# EAGLE design robot (EAGLE 9.6.2)
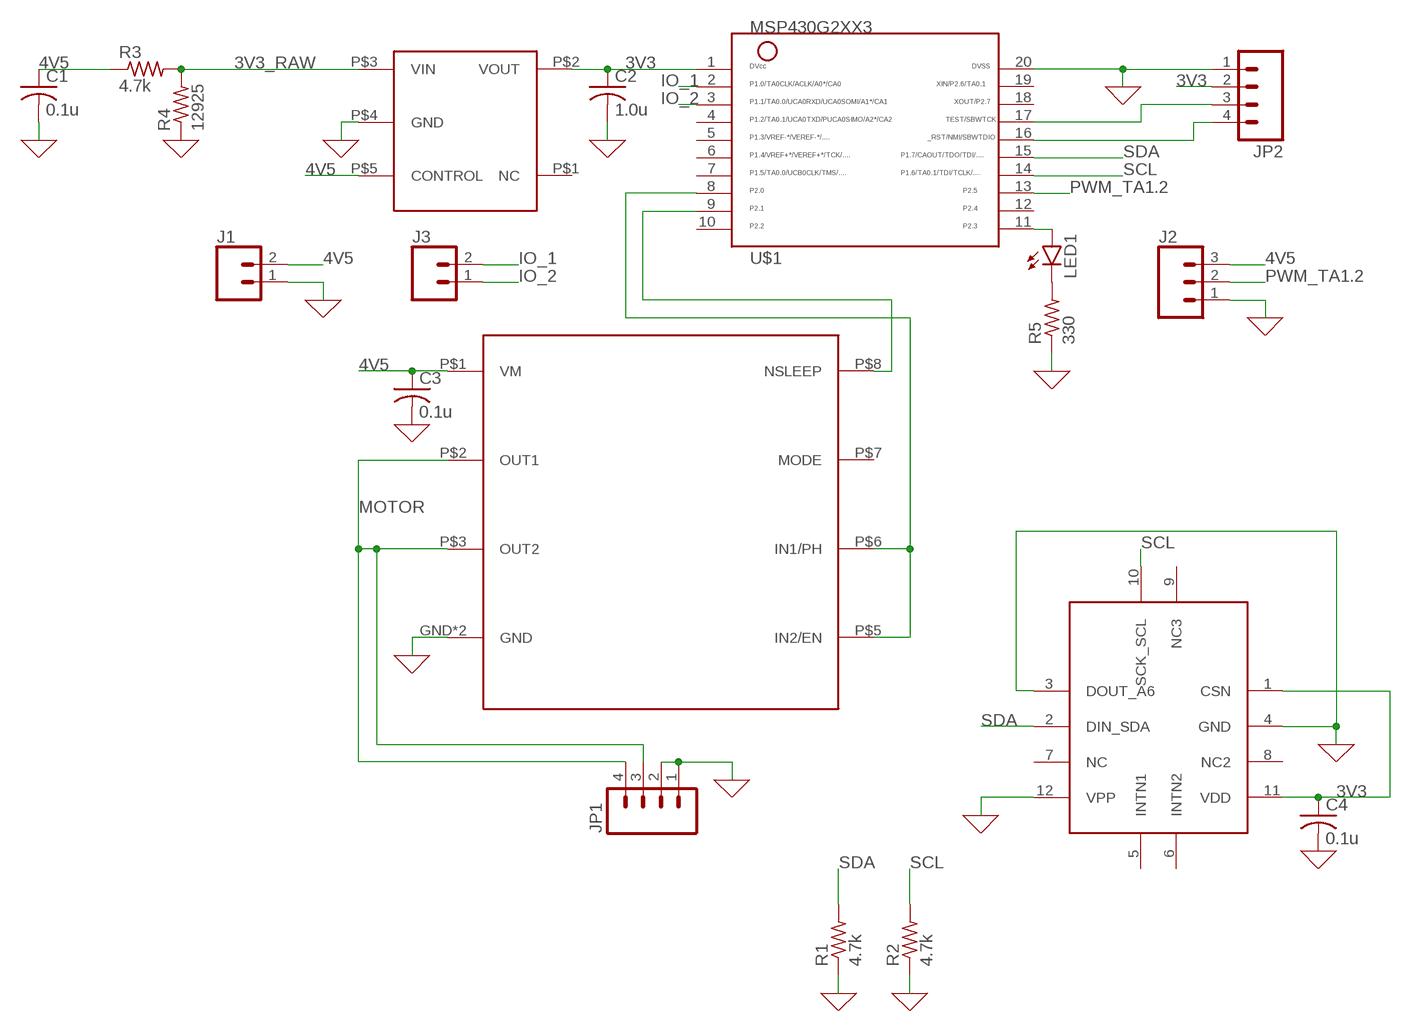
[diagram p0: schematic, sheet 1]

## Parts
C1  0.1u  C-USC0805  [C0805]
C2  1.0u  C-USC0805  [C0805]
C3  0.1u  C-USC0805  [C0805]
C4  0.1u  C-USC0805  [C0805]
J1  CONN_02  [1X02]
J2  CONN_03LOCK  [1X03_LOCK]
J3  CONN_02  [1X02]
JP1  HEADER_1X04LOCK  [1X04_LOCK]
JP2  HEADER_1X04LOCK  [1X04_LOCK]
LED1  LED5MM  [LED5MM]
R1  4.7k  R-US_R0805  [R0805]
R2  4.7k  R-US_R0805  [R0805]
R3  4.7k  R-US_R0805  [R0805]
R4  12925  R-US_R0805  [R0805]
R5  330  R-US_R0805  [R0805]
U$1  MSP430G2XX3PDIP  [N20]
U$2  DRV8220_H_BRIDGE  [DRV8220_H_BRIDGE]
U$4  TCR2EF3V3  [TCR2EF3V3]
U$5  MC3419VFLGA-12  [IC_MXC6655XA]

## Nets
0: C1.2 C2.2 C3.2 C4.2 J1.1 J2.1 JP1.1 JP1.2 JP2.1 R1.1 R2.1 R4.1 R5.1 U$1.20 U$2.GND U$2.P$4(GND) U$4.P$4(GND) U$5.3(DOUT_A6) U$5.4(GND) U$5.12(VPP) ; supply symbol labelled GND
3V3: C2.1 C4.1 JP2.2 U$1.1 U$4.P$2(VOUT) U$5.1(CSN) U$5.11(VDD)
3V3_RAW: R3.2 R4.2 U$4.P$3(VIN)
4V5: C1.1 C3.1 J1.2 J2.3 R3.1 U$2.P$1(VM) U$4.P$5(CONTROL)
IO_1: J3.2 U$1.2
IO_2: J3.1 U$1.3
MOTOR: JP1.3 JP1.4 U$2.P$2(OUT1) U$2.P$3(OUT2)
N$1: LED1.A U$1.11
N$2: U$1.9 U$2.P$8(NSLEEP)
N$3: LED1.K(C) R5.2
N$4: U$1.8 U$2.P$5(IN2/EN) U$2.P$6(IN1/PH)
N$10: JP2.3 U$1.17
N$11: JP2.4 U$1.16
PWM_TA1.2: J2.2 U$1.13
SCL: R2.2 U$1.14 U$5.10(SCK_SCL)
SDA: R1.2 U$1.15 U$5.2(DIN_SDA)
Unconnected: U$1.4 U$1.5 U$1.6 U$1.7 U$1.10 U$1.12 U$1.18 U$1.19 U$2.P$7(MODE) U$4.P$1(NC) U$5.5(INTN1) U$5.6(INTN2) U$5.7(NC) U$5.8(NC2) U$5.9(NC3)

## Library data of the parts
C1-C4 = rcl:C-US: CAPACITOR, American symbol; SPICEPREFIX: C
J1 J3 = SparkFun-Connectors:CONN_02: Multi connection point. Often used as Generic Header-pin footprint for 0.1 inch spaced/style header connections On any of the 0.1 inch spaced packages, you can populate with these: Break Away Headers - Straight <https://www.sparkfun.com/products/116> (PRT-00116) Break Away Male Headers - Right Angle <https://www.sparkfun.com/products/553> (PRT-00553) Female Headers <https://www.sparkfun.com/products/115> (PRT-00115) Break Away Headers - Machine Pin <https://www.sparkfun.com/products/117> (PRT-00117) Break Away Female Headers - Swiss Machine Pin <https://www.sparkfun.com/products/743> (PRT-00743) For SCREWTERMINALS and SPRING TERMINALS visit here: Screw Terimnals on SparkFun.com <https://www.sparkfun.com/search/results?term=Screw+Terminals> (5mm/3.5mm/2.54mm spacing) This device is also useful as a general connection point to wire up your design to another part of your project. Our various solder wires solder well into these plated through hole pads. Hook-Up Wire - Assortment (Stranded, 22 AWG) <https://www.sparkfun.com/products/11375> (PRT-11375) Hook-Up Wire - Assortment (Solid Core, 22 AWG) <https://www.sparkfun.com/products/11367> (PRT-11367) View the entire wire category on our website here <https://www.sparkfun.com/categories/141> Special notes: Molex polarized connector foot print use with: PRT-08233 with associated crimp pins and housings. 2.54_SCREWTERM for use with PRT-10571. 3.5mm Screw Terminal footprints for PRT-08084 5mm Screw Terminal footprints for use with PRT-08432
J2 = SparkFun-Connectors:CONN_03: Multi connection point. Often used as Generic Header-pin footprint for 0.1 inch spaced/style header connections On any of the 0.1 inch spaced packages, you can populate with these: Break Away Headers - Straight <https://www.sparkfun.com/products/116> (PRT-00116) Break Away Male Headers - Right Angle <https://www.sparkfun.com/products/553> (PRT-00553) Female Headers <https://www.sparkfun.com/products/115> (PRT-00115) Break Away Headers - Machine Pin <https://www.sparkfun.com/products/117> (PRT-00117) Break Away Female Headers - Swiss Machine Pin <https://www.sparkfun.com/products/743> (PRT-00743) Stackable Header - 3 Pin (Female, 0.1") <https://www.sparkfun.com/products/13875> (PRT-13875) For SCREWTERMINALS and SPRING TERMINALS visit here: Screw Terimnals on SparkFun.com <https://www.sparkfun.com/search/results?term=Screw+Terminals> (5mm/3.5mm/2.54mm spacing) This device is also useful as a general connection point to wire up your design to another part of your project. Our various solder wires solder well into these plated through hole pads. Hook-Up Wire - Assortment (Stranded, 22 AWG) <https://www.sparkfun.com/products/11375> (PRT-11375) Hook-Up Wire - Assortment (Solid Core, 22 AWG) <https://www.sparkfun.com/products/11367> (PRT-11367) View the entire wire category on our website here <https://www.sparkfun.com/categories/141> Special notes: Molex polarized connector foot print use with SKU : PRT-08232 with associated crimp pins and housings.
JP1 JP2 = ELEC327:HEADER_1X04: Header 4 Standard 4-pin 0.1" header. Use with straight break away headers (SKU : PRT-00116), right angle break away headers (PRT-00553), swiss pins (PRT-00743), machine pins (PRT-00117), and female headers (PRT-00115). Molex polarized connector foot print use with SKU : PRT-08231 with associated crimp pins and housings.
LED1 = led:LED: LED OSRAM: - CHIPLED LG R971, LG N971, LY N971, LG Q971, LY Q971, LO R971, LY R971 LH N974, LH R974 LS Q976, LO Q976, LY Q976 LO Q996 - Hyper CHIPLED LW Q18S LB Q993, LB Q99A, LB R99A - SideLED LS A670, LO A670, LY A670, LG A670, LP A670 LB A673, LV A673, LT A673, LW A673 LH A674 LY A675 LS A676, LA A676, LO A676, LY A676, LW A676 LS A679, LY A679, LG A679 - Hyper Micro SIDELED® LS Y876, LA Y876, LO Y876, LY Y876 LT Y87S - SmartLED LW L88C, LW L88S LB L89C, LB L89S, LG L890 LS L89K, LO L89K, LY L89K LS L896, LA L896, LO L896, LY L896 - TOPLED LS T670, LO T670, LY T670, LG T670, LP T670 LSG T670, LSP T670, LSY T670, LOP T670, LYG T670 LG T671, LOG T671, LSG T671 LB T673, LV T673, LT T673, LW T673 LH T674 LS T676, LA T676, LO T676, LY T676, LB T676, LH T676, LSB T676, LW T676 LB T67C, LV T67C, LT T67C, LS T67K, LO T67K, LY T67K, LW E67C LS E67B, LA E67B, LO E67B, LY E67B, LB E67C, LV E67C, LT E67C LW T67C LS T679, LY T679, LG T679 LS T770, LO T770, LY T770, LG T770, LP T770 LB T773, LV T773, LT T773, LW T773 LH T774 LS E675, LA E675, LY E675, LS T675 LS T776, LA T776, LO T776, LY T776, LB T776 LHGB T686 LT T68C, LB T68C - Hyper Mini TOPLED® LB M676 - Mini TOPLED Santana® LG M470 LS M47K, LO M47K, LY M47K Source: http://www.osram.convergy.de LUXEON: - LUMILED® LXK2-PW12-R00, LXK2-PW12-S00, LXK2-PW14-U00, LXK2-PW14-V00 LXK2-PM12-R00, LXK2-PM12-S00, LXK2-PM14-U00 LXK2-PE12-Q00, LXK2-PE12-R00, LXK2-PE12-S00, LXK2-PE14-T00, LXK2-PE14-U00 LXK2-PB12-K00, LXK2-PB12-L00, LXK2-PB12-M00, LXK2-PB14-N00, LXK2-PB14-P00, LXK2-PB14-Q00 LXK2-PR12-L00, LXK2-PR12-M00, LXK2-PR14-Q00, LXK2-PR14-R00 LXK2-PD12-Q00, LXK2-PD12-R00, LXK2-PD12-S00 LXK2-PH12-R00, LXK2-PH12-S00 LXK2-PL12-P00, LXK2-PL12-Q00, LXK2-PL12-R00 Source: www.luxeon.com KINGBRIGHT: KA-3528ASYC Source: www.kingbright.com
R1-R5 = rcl:R-US_: RESISTOR, American symbol; SPICEPREFIX: R
U$1 = ELEC327:MSP430G2XX3: MSP430G2XX3 PDIP (N) 20 Pin Package
U$2 = ELEC327:DRV8220_H_BRIDGE
U$4 = ELEC327:TCR2EF3V3
U$5 = ELEC327:MC3419

## Board
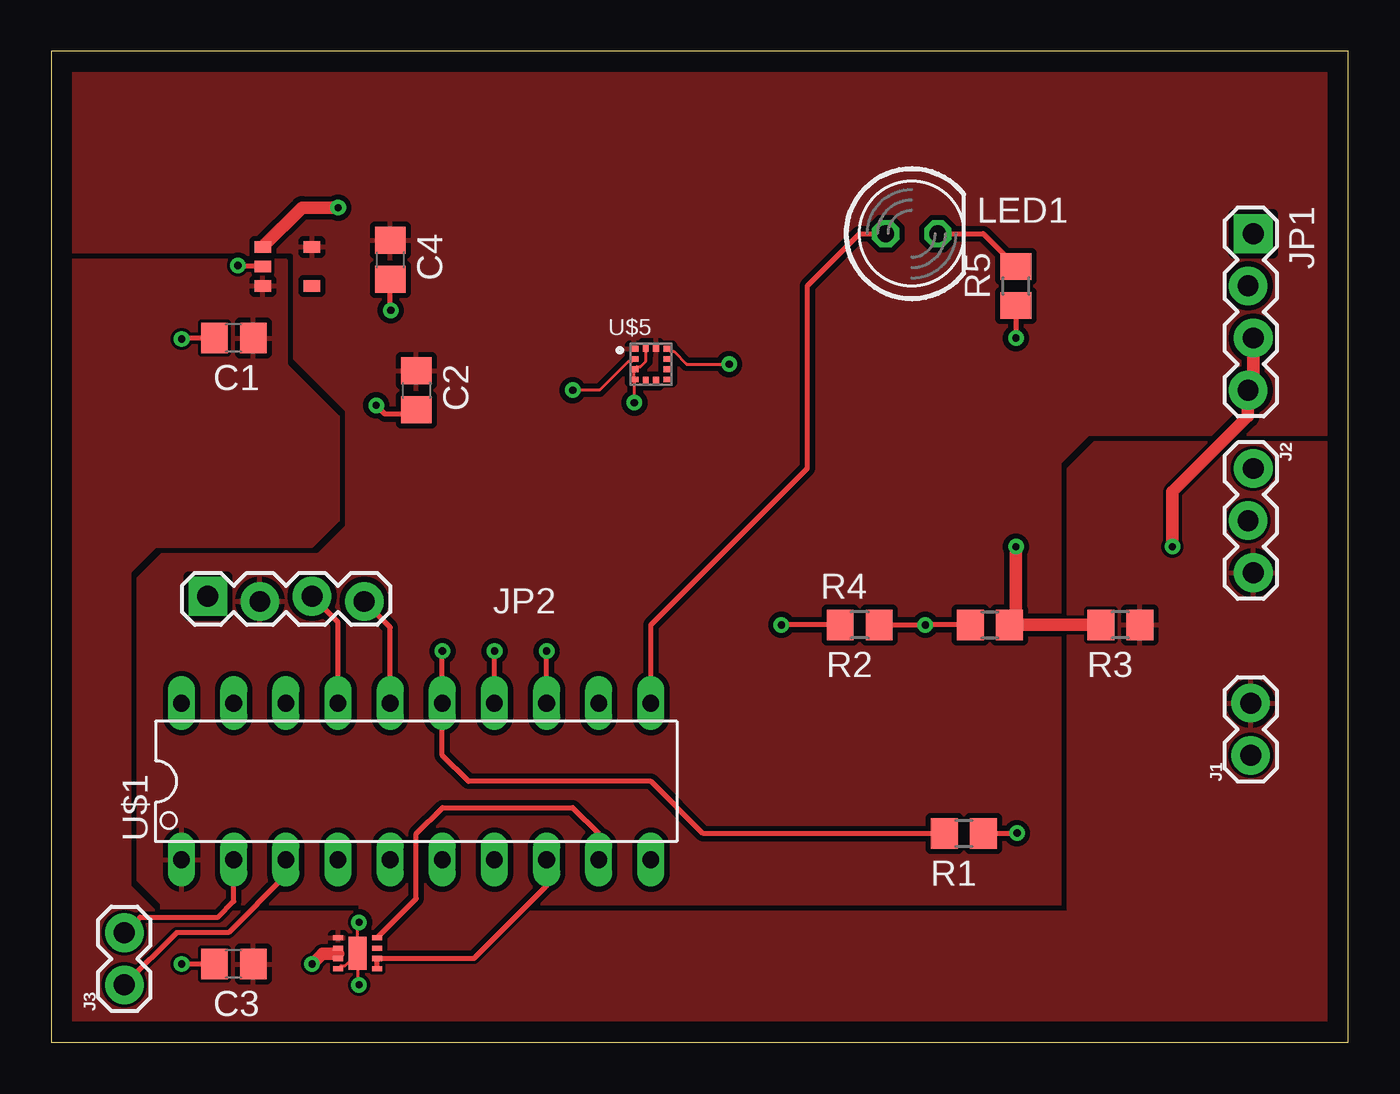
[diagram p1: board, top side]
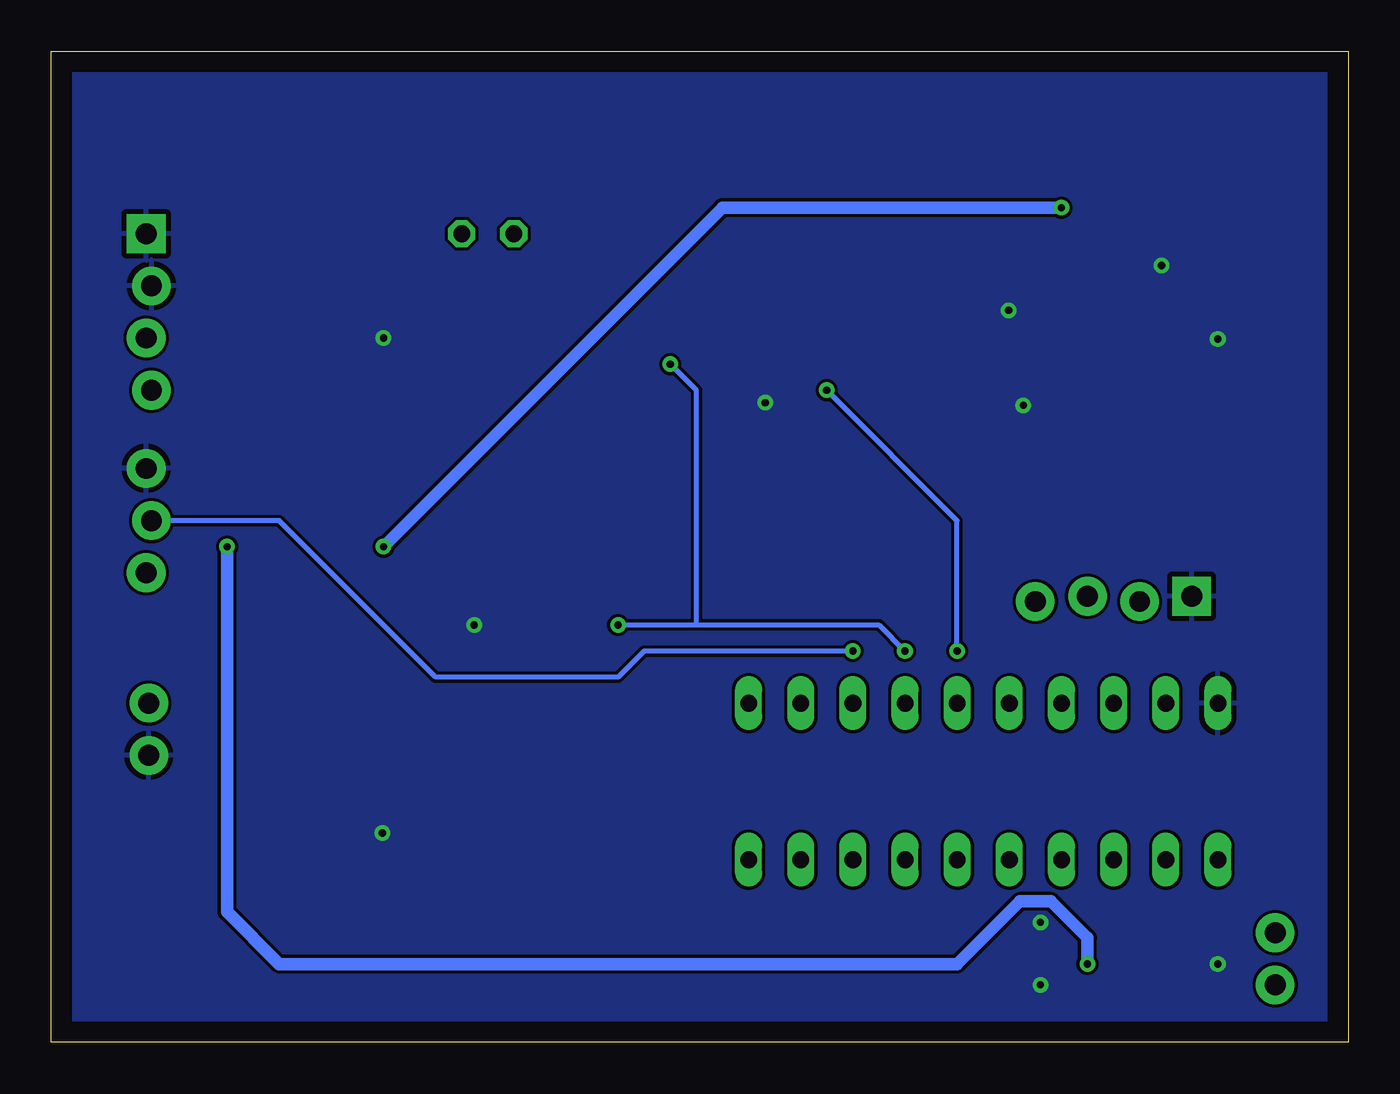
[diagram p2: board, bottom side, seen from below]

Size 63.17 x 48.25 mm. Coordinates in mm from the lower left corner, seen from the top.
Outline: 0,0 63.17,0 63.17,48.25 0,48.25 0,0
Copper layers (1*16): Top 0.035mm / dielectric 1.5mm / Bottom 0.035mm
Design rules "default": minimum track width 6mil, minimum drill 0.35mm, track to track 6mil, track to pad 6mil, pad to pad 6mil, via to via 6mil, smd to smd 6mil, copper to edge 40mil, drill to drill 6mil, minimum pad ring 10mil, minimum via ring 8mil, stop-mask expansion 4mil, vias tented up to drill 0mil, thermal gap 10mil

### Footprints (pad centres in the part's own frame; a part is rotated, then mirrored left to right if it is on the bottom)
C0805 = smd 1.3 x 1.5: 1 -0.95,0; 2 0.95,0
1X02 = drill 1.016 pad 1.88: 1 0,0; 2 2.54,0
1X03_LOCK = drill 1.016 pad 1.88: 1 0,0.127; 2 2.54,-0.127; 3 5.08,0.127
1X04_LOCK = drill 1.016 pad 1.88 square: 1 0,0.127 | drill 1.016 pad 1.88: 2 2.54,-0.127; 3 5.08,0.127; 4 7.62,-0.127
LED5MM = drill 0.813 octagon: A -1.27,0; K 1.27,0
R0805 = smd 1.3 x 1.5: 1 -0.95,0; 2 0.95,0
N20 = drill 0.813 long: 1 -11.435,-3.81; 2 -8.895,-3.81; 3 -6.355,-3.81; 4 -3.815,-3.81; 5 -1.275,-3.81; 6 1.265,-3.81; 7 3.805,-3.81; 8 6.345,-3.81; 9 8.885,-3.81; 10 11.425,-3.81; 11 11.425,3.81; 12 8.885,3.81; 13 6.345,3.81; 14 3.805,3.81; 15 1.265,3.81; 16 -1.275,3.81; 17 -3.815,3.81; 18 -6.355,3.81; 19 -8.895,3.81; 20 -11.435,3.81
DRV8220_H_BRIDGE = smd 0.9 x 1.6: GND 0.95,-0.747 | smd 0.5 x 0.25: P$1 0,0; P$2 0,-0.5; P$3 0,-1; P$4 0,-1.5; P$5 1.9,-1.5; P$6 1.9,-1; P$7 1.9,-0.5; P$8 1.9,0
TCR2EF3V3 = smd 0.8 x 0.55: P$1 0,0; P$2 0,-1.9; P$3 2.4,-1.9; P$4 2.4,-0.95; P$5 2.4,0
IC_MXC6655XA = smd 0.41 x 0.28: 1 -0.815,0.75; 2 -0.815,0.25; 3 -0.815,-0.25; 4 -0.815,-0.75; 7 0.815,-0.75; 8 0.815,-0.25; 9 0.815,0.25; 10 0.815,0.75 | smd 0.28 x 0.41: 5 -0.25,-0.815; 6 0.25,-0.815; 11 0.25,0.815; 12 -0.25,0.815

### Placement (x,y rotation side)
C1  8.89,34.29 180 top
C2  17.78,31.75 270 top
C3  8.89,3.81 180 top
C4  16.51,38.1 270 top
J1  58.42,13.97 90 top
J2  58.42,27.94 270 top
J3  3.56,2.79 90 top
JP1  58.42,39.37 270 top
JP2  7.62,21.59 0 top
LED1  41.91,39.37 0 top
R1  44.45,10.16 180 top
R2  39.37,20.32 180 top
R3  52.07,20.32 180 top
R4  45.72,20.32 0 top
R5  46.99,36.83 90 top
U$1  17.78,12.7 0 top
U$2  13.97,5.08 0 top
U$4  12.7,36.83 180 top
U$5  29.21,33.02 0 top

### Tracks (layer width: path | path; a pad name or v marks a point on that pad's centre or on a via)
0  (via drill 0.35)
  Top 0.152: 17.62,30.64 C2.2 17.56,30.58 | 10.48,37.78 U$4.P$4 | U$2.P$4 14.12,3.73 14.31,3.73 14.45,3.86 U$2.GND | U$5.12 28.96,33.17 28.7,32.9 28.53,32.9 U$5.3 U$5.4 v28.39,31.14 v28.4,31.14 | 9.13,37.78 v9.09,37.82 | v6.35,34.24 6.28,34.29 | 15.77,31.01 v15.82,31.01 | R1.1 45.42,10.18 | v16.54,35.64 16.51,35.66 | U$2.GND 14.92,5.84 v14.99,5.84 | U$2.GND 14.92,2.86 v14.99,2.79
  Top 0.254: R2.1 v42.57,20.32 R4.1 | U$4.P$4 9.13,37.78 | C1.2 6.28,34.29 | v15.82,31.01 16.26,30.58 17.56,30.58 | 45.42,10.18 v47.04,10.18 | 16.51,35.66 C4.2 | C3.2 v6.35,3.81 | R5.1 v46.99,34.29
  pour Bottom: 0,48.26 63.5,48.26 63.5,0 0,0
3V3
  pour Top (isolate 0.254, rank 2): 0,48.26 63.5,48.26 63.5,0 0,0
3V3_RAW  (via drill 0.35)
  Top 0.152: R4.2 46.99,20.64
  Top 0.61: R4.2 R3.2 | 46.99,20.64 v46.99,24.13 | U$4.P$3 12.21,40.64 v13.97,40.64
  Bottom 0.61: v13.97,40.64 30.48,40.64 v46.99,24.13
4V5
  pour Top: 0,38.1 11.43,38.1 11.43,33.02 13.97,30.48 13.97,25.4 12.7,24.13 5.08,24.13 3.81,22.86 3.81,7.62 5.08,6.35 49.53,6.35 49.53,27.94 50.8,29.21 62.23,29.21 62.23,0 0,0
IO_1
  Top 0.152: U$1.2
  Top 0.254: J3.2 4.32,6.1 8.13,6.1 8.89,6.86 U$1.2
IO_2
  Top 0.254: U$1.3 11.43,8.12 8.64,5.33 6.1,5.33 J3.1
MOTOR  (via drill 0.35)
  Top 0.152: U$2.P$2 13.97,4.32 U$2.P$3
  Top 0.61: v54.61,24.13 54.61,26.8 58.29,30.48 JP1.4 58.55,32 JP1.3 | v12.7,3.81 13.21,4.32 13.97,4.32
  Bottom 0.61: v12.7,3.81 12.7,5.08 14.48,6.86 16,6.86 19.05,3.81 52.07,3.81 54.61,6.35 v54.61,24.13
N$1
  Top 0.152: U$1.11
  Top 0.254: LED1.A 39.37,39.37 36.83,36.83 36.83,27.94 33.02,24.13 29.21,20.32 U$1.11
N$2
  Top 0.254: U$2.P$8 17.78,6.99 17.78,10.16 19.05,11.43 25.4,11.43 26.66,10.16 U$1.9
N$3
  Top 0.254: LED1.K 45.4,39.37 R5.2
N$4
  Top 0.152: U$1.8
  Top 0.254: U$2.P$5 U$2.P$6 20.59,4.08 24.13,7.62 U$1.8
N$10
  Top 0.254: U$1.17 13.96,20.45 JP2.3
N$11
  Top 0.254: U$1.16 16.5,20.2 JP2.4
PWM_TA1.2  (via drill 0.35)
  Top 0.152: U$1.13
  Top 0.254: U$1.13 v24.13,19.05
  Bottom 0.254: v24.13,19.05 34.29,19.05 35.56,17.78 44.45,17.78 52.07,25.4 J2.2
SCL  (via drill 0.35)
  Top 0.152: v21.59,19.05 | U$5.10 30.16,33.64 30.32,33.64 30.94,33.02 v33.02,33.02
  Top 0.254: R2.2 v35.56,20.32 | U$1.14 v21.59,19.05
  Bottom 0.254: v35.56,20.32 31.75,20.32 | 31.75,20.32 22.86,20.32 v21.59,19.05 | 31.75,20.32 31.75,31.75 v33.02,33.02
SDA  (via drill 0.35)
  Top 0.152: U$5.2 28.26,33.14 28.09,33.14 26.71,31.75 v25.4,31.75 | v19.05,19.05
  Top 0.254: v19.05,19.05 U$1.15 19.05,13.98 20.32,12.7 29.21,12.7 31.75,10.16 R1.2
  Bottom 0.254: v19.05,19.05 19.05,25.4 v25.4,31.75